# EAGLE design SNIFFR (EAGLE 9.6.0)
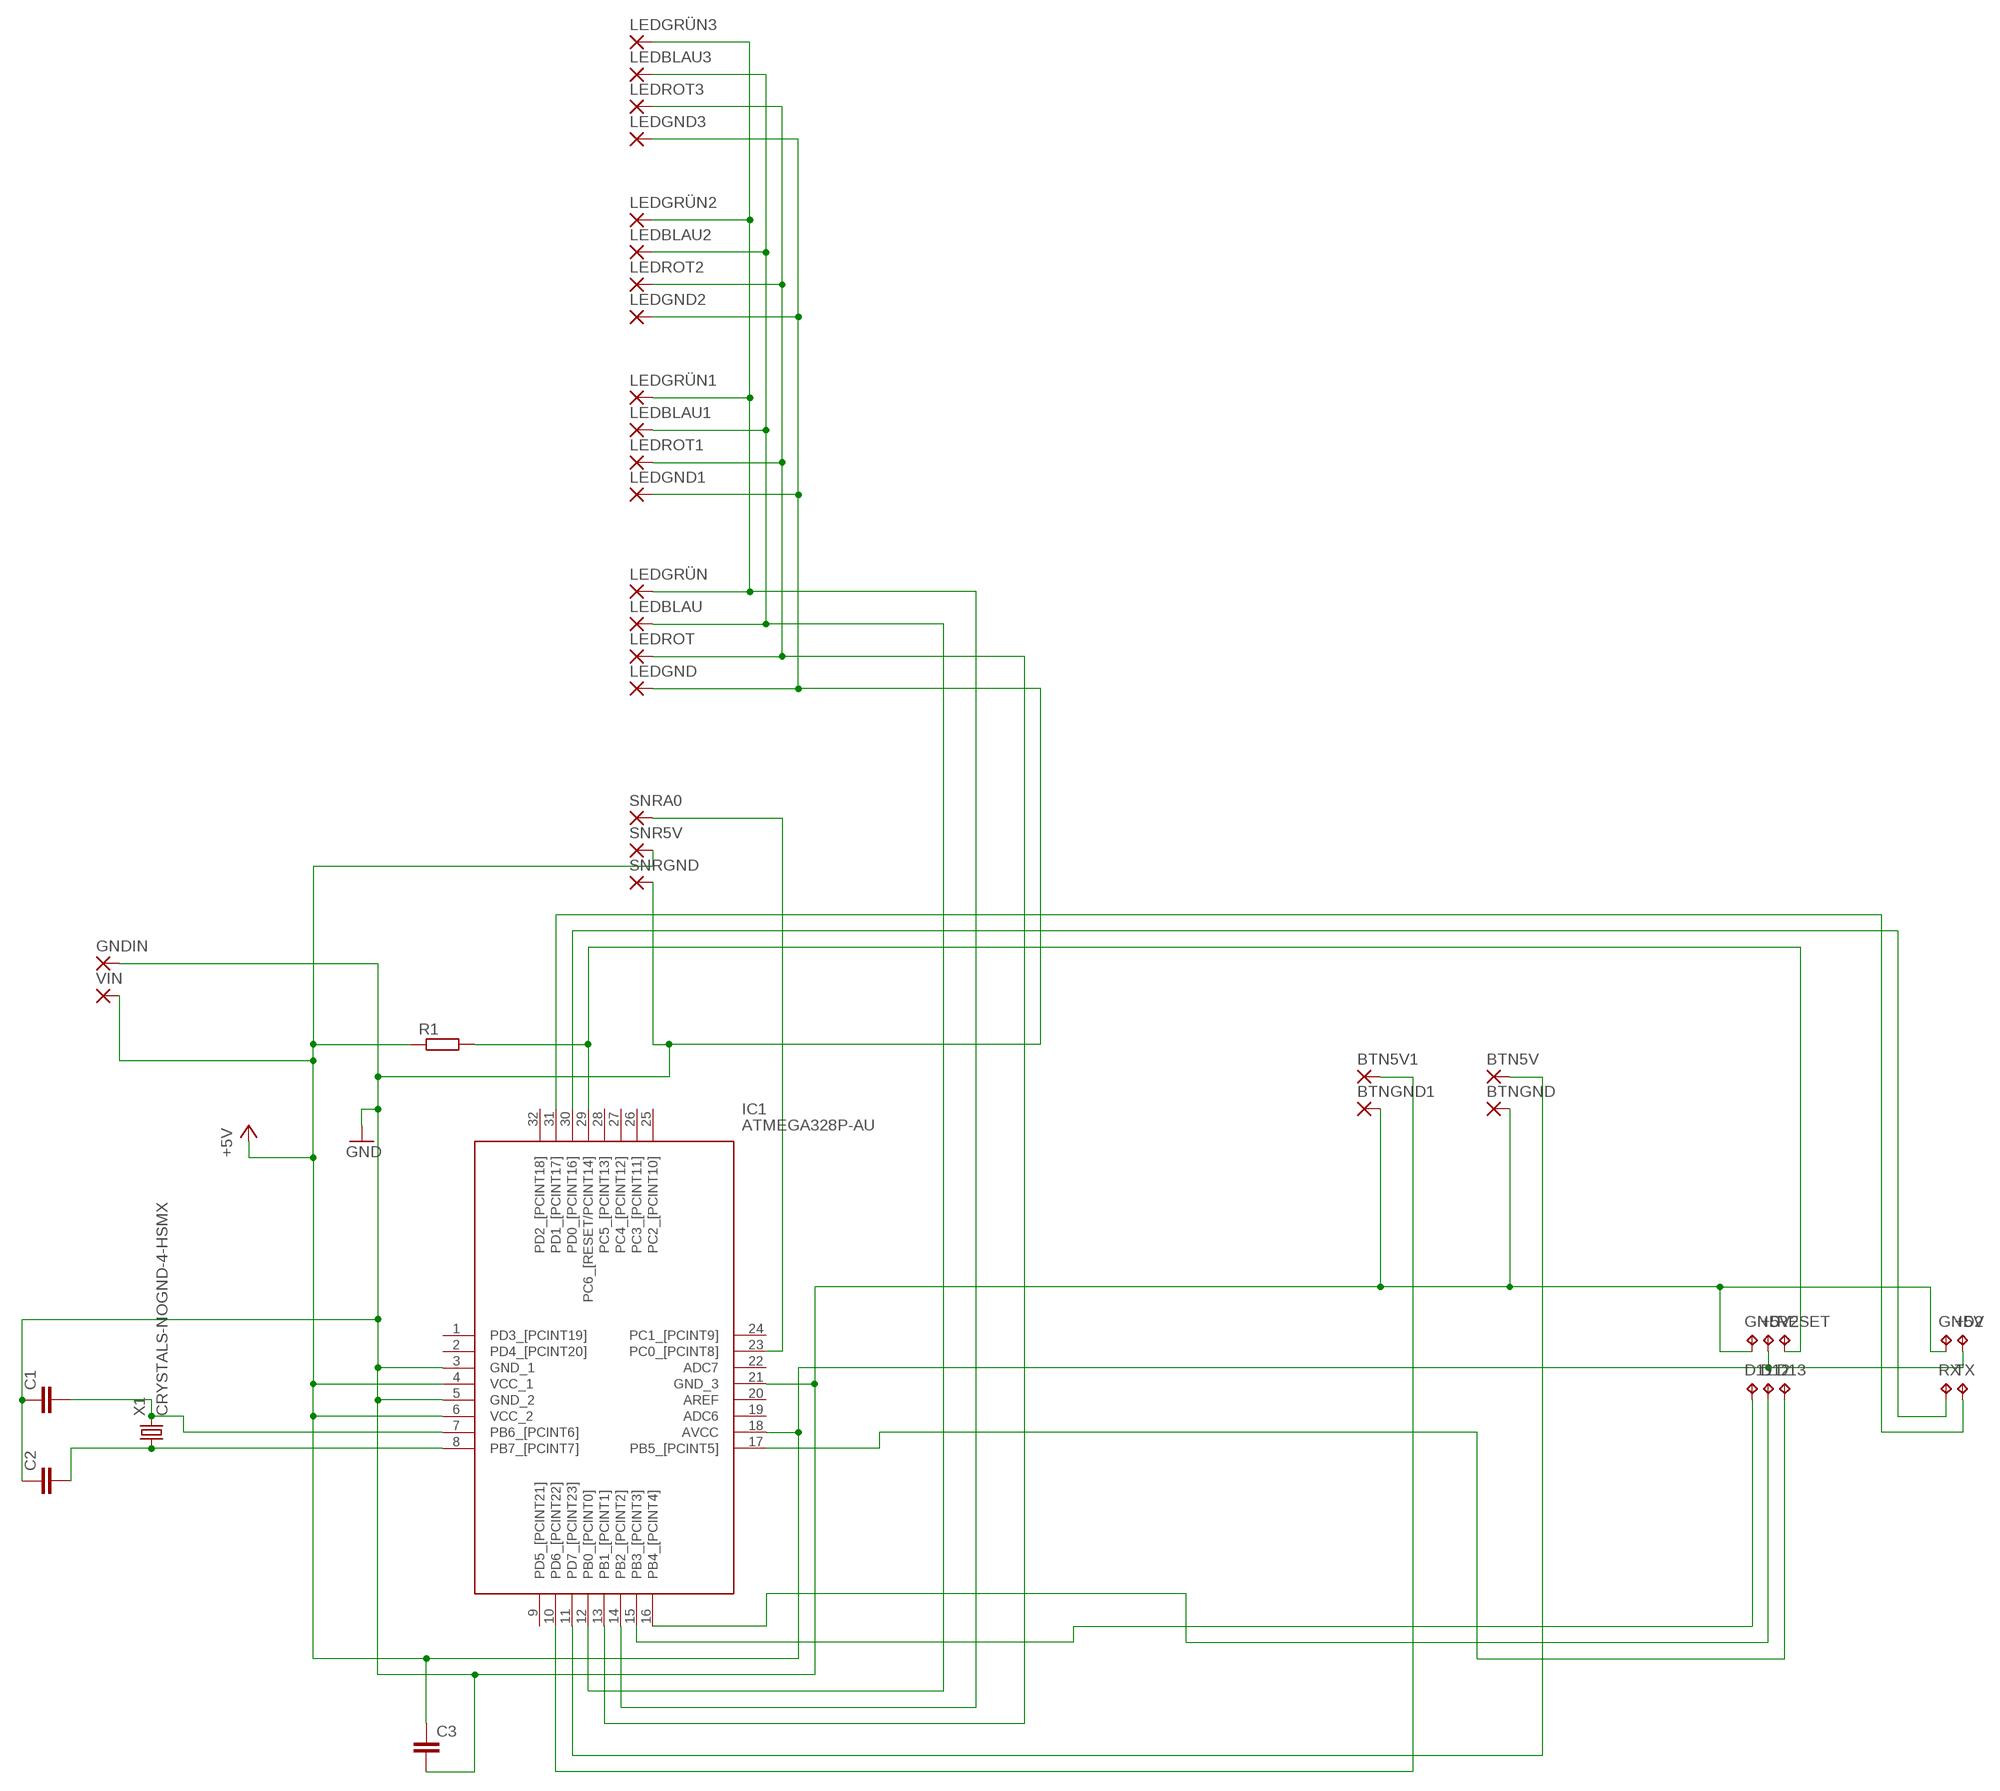
[diagram p0: schematic, sheet 1]

## Parts
+5V  TPTP15SQ  [TP15SQ]
+5V2  TPTP15SQ  [TP15SQ]
BTN5V  2,15/1,0  [2,15/1,0]
BTN5V1  2,15/1,0  [2,15/1,0]
BTNGND  2,15/1,0  [2,15/1,0]
BTNGND1  2,15/1,0  [2,15/1,0]
C1  C-EUC0805  [C0805]
C2  C-EUC0805  [C0805]
C3  C-EUC0805  [C0805]
D11  TPTP15SQ  [TP15SQ]
D12  TPTP15SQ  [TP15SQ]
D13  TPTP15SQ  [TP15SQ]
GND  TPTP15SQ  [TP15SQ]
GND2  TPTP15SQ  [TP15SQ]
GNDIN  2,15/1,0  [2,15/1,0]
IC1  ATMEGA328P-AU  [QFP80P900X900X120-32N]
LEDBLAU  2,15/1,0  [2,15/1,0]
LEDBLAU1  2,15/1,0  [2,15/1,0]
LEDBLAU2  2,15/1,0  [2,15/1,0]
LEDBLAU3  2,15/1,0  [2,15/1,0]
LEDGND  2,15/1,0  [2,15/1,0]
LEDGND1  2,15/1,0  [2,15/1,0]
LEDGND2  2,15/1,0  [2,15/1,0]
LEDGND3  2,15/1,0  [2,15/1,0]
LEDGRÜN  2,15/1,0  [2,15/1,0]
LEDGRÜN1  2,15/1,0  [2,15/1,0]
LEDGRÜN2  2,15/1,0  [2,15/1,0]
LEDGRÜN3  2,15/1,0  [2,15/1,0]
LEDROT  2,15/1,0  [2,15/1,0]
LEDROT1  2,15/1,0  [2,15/1,0]
LEDROT2  2,15/1,0  [2,15/1,0]
LEDROT3  2,15/1,0  [2,15/1,0]
R1  R-EU_R0805  [R0805]
RESET  TPTP15SQ  [TP15SQ]
RX  TPTP15SQ  [TP15SQ]
SNR5V  2,15/1,0  [2,15/1,0]
SNRA0  2,15/1,0  [2,15/1,0]
SNRGND  2,15/1,0  [2,15/1,0]
TX  TPTP15SQ  [TP15SQ]
VIN  2,15/1,0  [2,15/1,0]
X1  CRYSTALS-NOGND-4-HSMX  [HC49-4-HSMX]

## Nets
+5V [POWER]: +5V2.TP +5V.TP C3.1 IC1.4(VCC_1) IC1.6(VCC_2) IC1.18(AVCC) R1.1 SNR5V.1(P) VIN.1(P)
GND [POWER]: BTNGND1.1(P) BTNGND.1(P) C1.1 C2.1 C3.2 GND2.TP GND.TP GNDIN.1(P) IC1.3(GND_1) IC1.5(GND_2) IC1.21(GND_3) LEDGND1.1(P) LEDGND2.1(P) LEDGND3.1(P) LEDGND.1(P) SNRGND.1(P)
N$1: BTN5V1.1(P) IC1.10(PD6_[PCINT22])
N$2 [DATA]: IC1.29(PC6_[RESET/PCINT14]) R1.2 RESET.TP
N$3 [DATA]: C1.2 IC1.7(PB6_[PCINT6]) X1.2
N$4 [DATA]: C2.2 IC1.8(PB7_[PCINT7]) X1.1
N$5: IC1.13(PB1_[PCINT1]) LEDROT1.1(P) LEDROT2.1(P) LEDROT3.1(P) LEDROT.1(P)
N$6: IC1.14(PB2_[PCINT2]) LEDGRÜN1.1(P) LEDGRÜN2.1(P) LEDGRÜN3.1(P) LEDGRÜN.1(P)
N$7: IC1.12(PB0_[PCINT0]) LEDBLAU1.1(P) LEDBLAU2.1(P) LEDBLAU3.1(P) LEDBLAU.1(P)
N$8: IC1.23(PC0_[PCINT8]) SNRA0.1(P)
N$9 [DATA]: D11.TP IC1.15(PB3_[PCINT3])
N$10 [DATA]: D12.TP IC1.16(PB4_[PCINT4])
N$11 [DATA]: D13.TP IC1.17(PB5_[PCINT5])
N$12 [DATA]: IC1.30(PD0_[PCINT16]) RX.TP
N$13 [DATA]: IC1.31(PD1_[PCINT17]) TX.TP
N$15: BTN5V.1(P) IC1.11(PD7_[PCINT23])
Unconnected: IC1.1(PD3_[PCINT19]) IC1.2(PD4_[PCINT20]) IC1.9(PD5_[PCINT21]) IC1.19(ADC6) IC1.20(AREF) IC1.22(ADC7) IC1.24(PC1_[PCINT9]) IC1.25(PC2_[PCINT10]) IC1.26(PC3_[PCINT11]) IC1.27(PC4_[PCINT12]) IC1.28(PC5_[PCINT13]) IC1.32(PD2_[PCINT18])

## Library data of the parts
+5V +5V2 D11-D13 GND GND2 RESET RX TX = testpad:TP: Test pad
BTN5V BTN5V1 BTNGND BTNGND1 GNDIN LEDBLAU LEDBLAU1-LEDBLAU3 LEDGND LEDGND1-LEDGND3 LEDGRÜN LEDGRÜN1-LEDGRÜN3 LEDROT LEDROT1-LEDROT3 SNR5V SNRA0 SNRGND VIN = wirepad:2,15/1,0: THROUGH-HOLE PAD
C1-C3 = rcl:C-EU: CAPACITOR, European symbol; SPICEPREFIX: C
IC1 = ATMEGA328P-AU:ATMEGA328P-AU: MICROCHIP - ATMEGA328P-AU. - MICROCONTROLLER MCU, 8 BIT, ATMEGA, 20MHZ, TQFP-32 Source: Datasheet <https://componentsearchengine.com/Datasheets/2/ATMEGA328P-AU.pdf>; ARROW_PART_NUMBER: ATMEGA328P-AU; ARROW_PRICE-STOCK: https://www.arrow.com/en/products/atmega328p-au/microchip-technology; DESCRIPTION: MICROCHIP - ATMEGA328P-AU. - MICROCONTROLLER MCU, 8 BIT, ATMEGA, 20MHZ, TQFP-32; HEIGHT: 1.2mm; MANUFACTURER_NAME: Microchip; MANUFACTURER_PART_NUMBER: ATMEGA328P-AU; MOUSER_PART_NUMBER: 556-ATMEGA328P-AU; MOUSER_PRICE-STOCK: https://www.mouser.co.uk/ProductDetail/Microchip-Technology-Atmel/ATMEGA328P-AU?qs=K8BHR703ZXiCmmgp6%2FGNmQ%3D%3D
R1 = rcl:R-EU_: RESISTOR, European symbol; SPICEPREFIX: R
X1 = IQD-Frequency-Products:CRYSTALS-NOGND: CRYSTALS CAN NOT GROUNDED

## Net classes
1 POWER: width 0.406 mm
2 DATA: width 0.254 mm

## Board
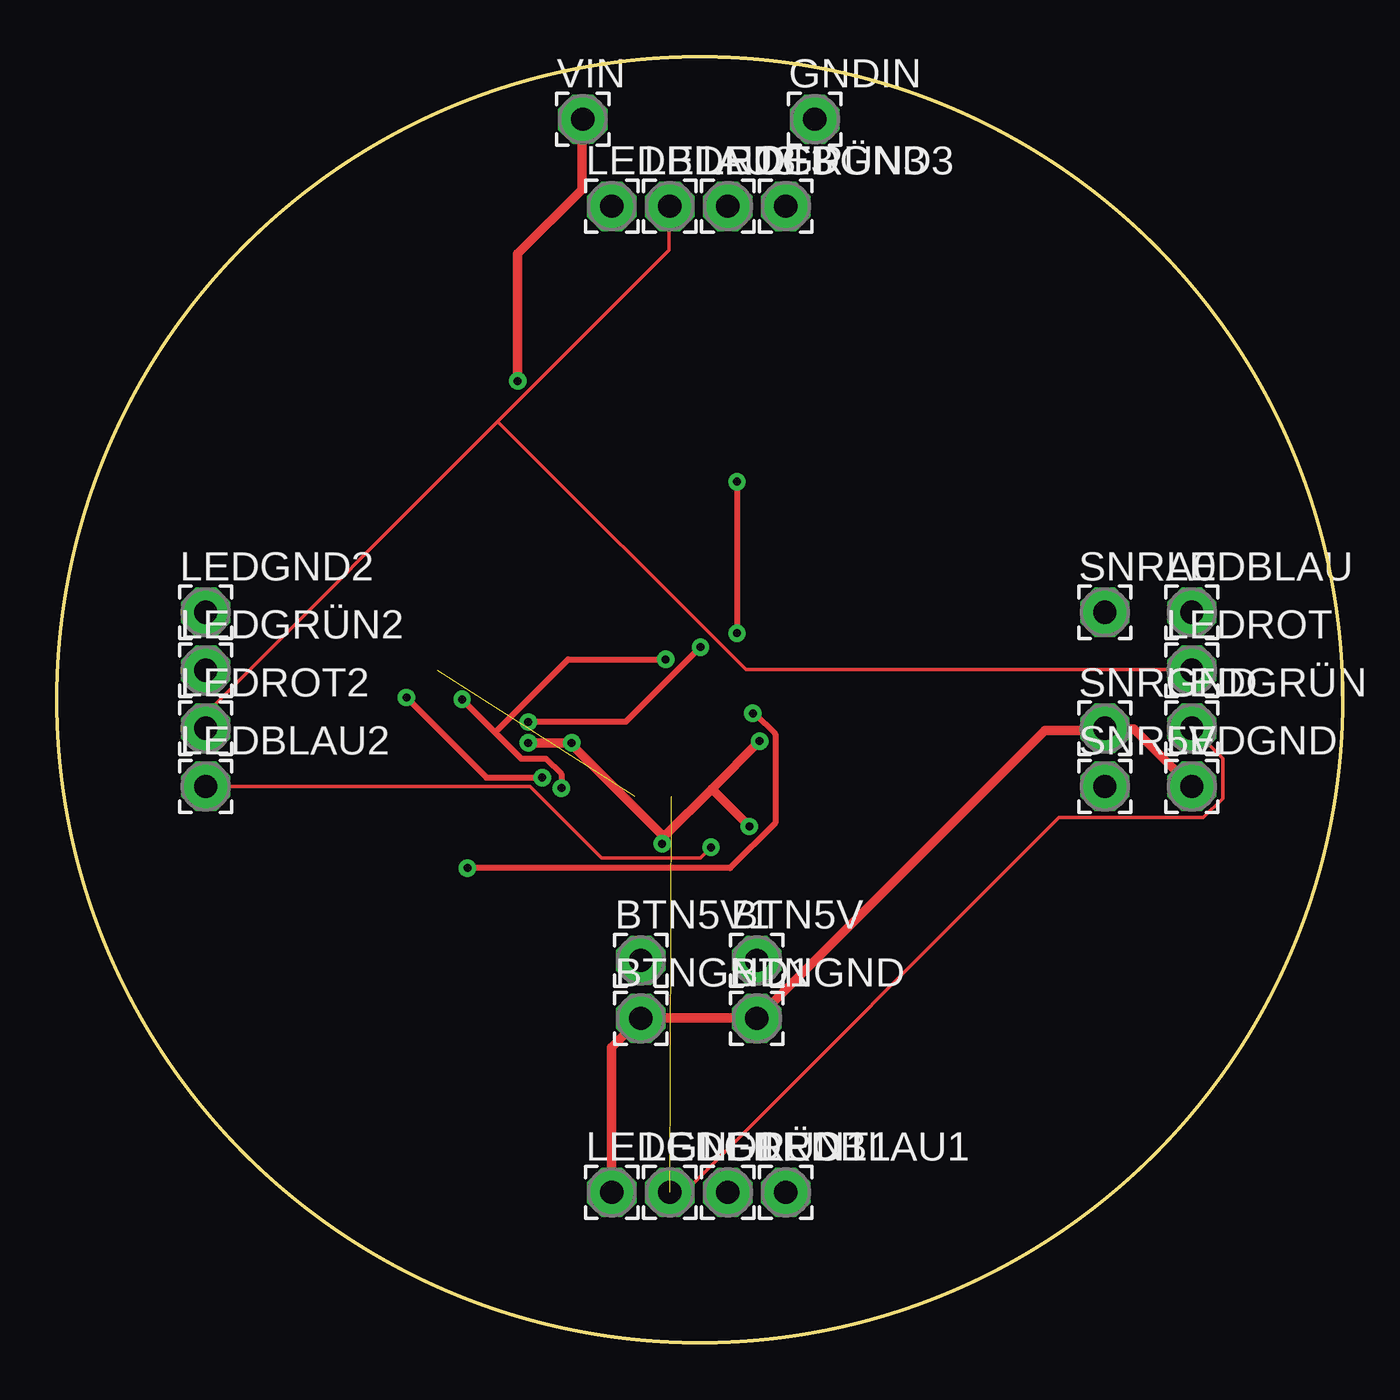
[diagram p1: board, top side]
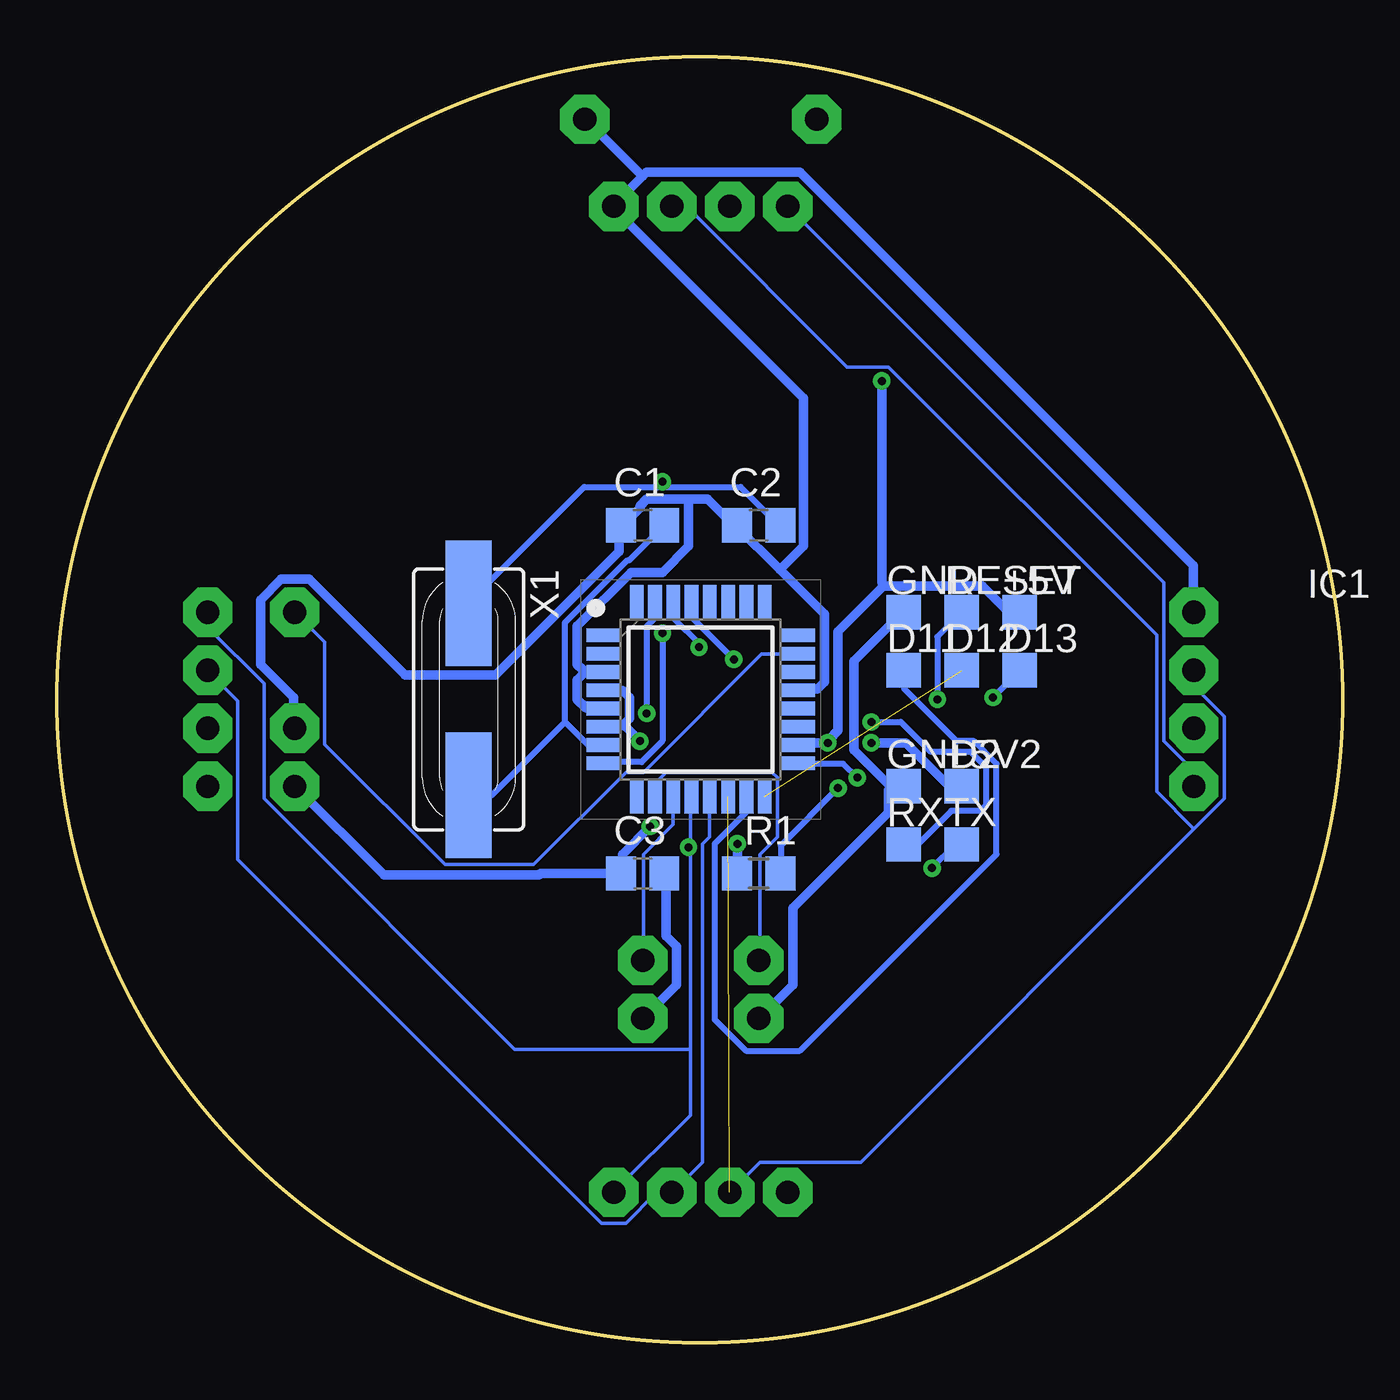
[diagram p2: board, bottom side, seen from below]

Size 56.28 x 56.28 mm. Coordinates in mm from the lower left corner, seen from the top.
Outline: circle at 28.14,28.14 radius 28.14
Copper layers (1*16): Top 0.035mm / dielectric 1.5mm / Bottom 0.035mm
Design rules "default": minimum track width 6mil, minimum drill 0.35mm, track to track 6mil, track to pad 6mil, pad to pad 6mil, via to via 6mil, smd to smd 6mil, copper to edge 40mil, drill to drill 6mil, minimum pad ring 10mil, minimum via ring 8mil, stop-mask expansion 4mil, vias tented up to drill 0mil, thermal gap 10mil

### Footprints (pad centres in the part's own frame; a part is rotated, then mirrored left to right if it is on the bottom)
TP15SQ = smd 1.5 x 1.5: TP 0,0
2,15/1,0 = drill 1.016 pad 2.159 octagon: 1 0,0
C0805 = smd 1.3 x 1.5: 1 -0.95,0; 2 0.95,0
QFP80P900X900X120-32N = smd 1.5 x 0.6: 1 -4.25,2.8; 2 -4.25,2; 3 -4.25,1.2; 4 -4.25,0.4; 5 -4.25,-0.4; 6 -4.25,-1.2; 7 -4.25,-2; 8 -4.25,-2.8; 17 4.25,-2.8; 18 4.25,-2; 19 4.25,-1.2; 20 4.25,-0.4; 21 4.25,0.4; 22 4.25,1.2; 23 4.25,2; 24 4.25,2.8 | smd 0.6 x 1.5: 9 -2.8,-4.25; 10 -2,-4.25; 11 -1.2,-4.25; 12 -0.4,-4.25; 13 0.4,-4.25; 14 1.2,-4.25; 15 2,-4.25; 16 2.8,-4.25; 25 2.8,4.25; 26 2,4.25; 27 1.2,4.25; 28 0.4,4.25; 29 -0.4,4.25; 30 -1.2,4.25; 31 -2,4.25; 32 -2.8,4.25
R0805 = smd 1.3 x 1.5: 1 -0.95,0; 2 0.95,0
HC49-4-HSMX = smd 5.5 x 2: 1 -4.2,0; 2 4.2,0

### Placement (x,y rotation side)
+5V  14.13,31.97 0 bottom
+5V2  16.67,24.35 0 bottom
BTN5V  30.64,16.73 0 top
BTN5V1  25.56,16.73 0 top
BTNGND  30.64,14.19 0 top
BTNGND1  25.56,14.19 0 top
C1  30.64,35.78 0 bottom
C2  25.56,35.78 0 bottom
C3  30.64,20.54 0 bottom
D11  19.21,29.43 0 bottom
D12  16.67,29.43 0 bottom
D13  14.13,29.43 0 bottom
GND  19.21,31.97 0 bottom
GND2  19.21,24.35 0 bottom
GNDIN  33.18,53.56 0 top
IC1  28.1,28.16 0 bottom
LEDBLAU  49.69,31.97 0 top
LEDBLAU1  31.91,6.57 0 top
LEDBLAU2  6.51,24.35 0 top
LEDBLAU3  24.29,49.75 0 top
LEDGND  49.69,24.35 0 top
LEDGND1  24.29,6.57 0 top
LEDGND2  6.51,31.97 0 top
LEDGND3  31.91,49.75 0 top
LEDGRÜN  49.69,26.89 0 top
LEDGRÜN1  26.83,6.57 0 top
LEDGRÜN2  6.51,29.43 0 top
LEDGRÜN3  29.37,49.75 0 top
LEDROT  49.69,29.43 0 top
LEDROT1  29.37,6.57 0 top
LEDROT2  6.51,26.89 0 top
LEDROT3  26.83,49.75 0 top
R1  25.56,20.54 0 bottom
RESET  16.67,31.97 0 bottom
RX  19.21,21.81 0 bottom
SNR5V  45.88,24.35 0 top
SNRA0  45.88,31.97 0 top
SNRGND  45.88,26.89 0 top
TX  16.67,21.81 0 bottom
VIN  23.02,53.56 0 top
X1  38.26,28.16 270 bottom

### Tracks (layer width: path | path; a pad name or v marks a point on that pad's centre or on a via)
+5V  (via drill 0.35)
  Top 0.406: v20.63,26.25 v22.54,26.25 22.61,26.1 26.5,22.21 | 26.5,22.21 v26.5,21.83 | 28.67,24.23 26.65,22.21 26.5,22.21 | 28.67,24.23 v30.77,26.33 | v20.17,42.1 20.17,47.67 22.99,50.49 22.99,53.53 VIN.1 | 28.67,24.23 v30.31,22.6
  Bottom 0.406: SNR5V.1 45.85,24.35 41.97,20.46 35.19,20.46 35.11,20.54 C3.1 31.53,20.69 31.53,21.38 v30.31,22.6 | 31.53,27.02 32.29,27.02 IC1.6 | 31.53,27.02 31.22,27.32 31.22,28.23 31.53,28.54 32.29,28.54 IC1.4 | +5V2.TP 17.2,24.35 19.11,26.25 v20.63,26.25 | IC1.18 23.83,26.18 23.76,26.25 v22.54,26.25 22.46,26.41 22.08,26.79 22.08,31.13 20.1,33.11 | +5V.TP 14.61,31.97 15.75,33.11 20.1,33.11 | v26.5,21.83 R1.1 | v30.77,26.33 31.38,26.94 31.53,27.02 | v20.17,42.1 20.17,33.26 20.1,33.11
GND
  Top 0.406: LEDGND.1 49.66,24.35 47.15,26.86 45.93,26.86 SNRGND.1 45.7,26.79 43.26,26.79 30.77,14.29 BTNGND.1 30.61,14.21 25.74,14.21 BTNGND1.1 24.29,12.92 LEDGND1.1
  Bottom 0.406: 33.2,29.3 33.51,29 33.51,28.16 33.13,27.78 32.37,27.78 IC1.5 | 33.2,29.3 32.37,29.3 IC1.3 | 24.63,33.84 26.57,35.78 C2.1 26.73,35.85 27.79,36.92 28.63,36.92 | 24.63,33.84 22.69,31.89 22.69,28.92 22.99,28.62 23.83,28.62 IC1.21 | 28.63,36.92 30.46,36.92 30.77,36.62 30.77,36.54 31.53,35.78 C1.1 31.68,35.63 31.68,34.64 37.09,29.23 41.05,29.23 45.24,33.42 46.46,33.42 47.38,32.5 47.38,29.68 45.93,28.23 45.93,26.94 SNRGND.1 | 28.63,36.92 28.63,34.86 29.77,33.72 31.15,33.72 33.51,31.36 33.51,29.68 33.28,29.45 33.2,29.3 | 30.65,51.06 31.91,49.8 LEDGND3.1 31.83,49.57 23.6,41.34 23.6,34.86 24.63,33.84 | 30.65,51.06 30.46,51.25 23.76,51.25 6.53,34.03 6.53,31.97 LEDGND2.1 | 30.65,51.06 33.13,53.53 GNDIN.1 | BTNGND.1 29.17,15.66 29.17,17.34 29.62,17.8 29.62,20.54 C3.2 | GND.TP 19.26,31.97 21.39,29.83 21.39,25.95 19.79,24.35 GND2.TP 19.87,24.2 19.87,23.21 24.06,19.01 24.06,15.66 25.51,14.21 BTNGND1.1
N$1
  Bottom 0.152: IC1.10 30.08,23.97 30.08,24.5 29.62,24.96 24.97,24.96 24.75,24.73 24.75,22.14 25.51,21.38 25.51,16.73 BTN5V1.1
N$2  (via drill 0.35)
  Top 0.254: v22.08,24.27 22.08,24.88 21.39,25.57 20.33,25.57 19.18,26.71 | v17.74,28.16 19.18,26.71 | v26.65,29.91 22.38,29.91 19.18,26.71
  Bottom 0.254: v22.08,24.27 24.59,21.76 24.59,20.54 R1.2 | v17.74,28.16 17.74,30.9 RESET.TP | v26.65,29.91 28.48,31.74 28.48,32.35 IC1.29
N$3
  Bottom 0.254: 34.04,27.17 34.04,31.51 31.3,34.25 31.22,34.25 C1.2 | 34.04,27.17 33.05,26.18 32.37,26.18 IC1.7 | 34.04,27.17 37.24,23.97 38.23,23.97 X1.2
N$4  (via drill 0.35)
  Top 0.254: v29.77,37.68 v29.77,31.05
  Bottom 0.254: 29.77,37.45 33.2,37.45 38.23,32.43 X1.1 | 29.77,37.45 26.35,37.45 24.67,35.78 C2.2 | v29.77,31.05 29.77,26.33 30.69,25.42 32.29,25.42 IC1.8 | 29.77,37.45 v29.77,37.68
N$5
  Top 0.152: 19.3,40.31 26.8,47.82 26.8,49.72 LEDROT3.1 | 19.3,40.31 6.53,27.55 6.53,26.94 LEDROT2.1 | 19.3,40.31 30.16,29.45 49.66,29.45 LEDROT.1
  Bottom 0.152: IC1.13 27.72,23.89 27.72,22.14 28.02,21.83 28.02,7.89 29.32,6.59 LEDROT1.1 29.39,6.52 30.08,6.52 31.38,5.22 32.44,5.22 48.37,21.15 48.37,28.08 49.66,29.38 LEDROT.1
N$6  (1 unrouted)
  Top 0.152: LEDGRÜN1.1 26.88,6.59 27.49,6.59 43.87,22.98 50.2,22.98 51.03,23.82 51.03,25.57 49.74,26.86 LEDGRÜN.1
  Bottom 0.152: 6.5,22.48 21.09,7.89 25.51,7.89 LEDGRÜN1.1 | 6.5,22.48 5.16,23.82 5.16,27.4 6.46,28.69 6.46,29.38 LEDGRÜN2.1 | 6.5,22.48 8.13,24.12 8.13,30.98 19.87,42.71 21.7,42.71 28.71,49.72 29.32,49.72 LEDGRÜN3.1
N$7  (via drill 0.35)
  Top 0.152: LEDBLAU2.1 20.71,24.35 23.83,21.22 28.17,21.22 v28.63,21.68
  Bottom 0.152: LEDBLAU2.1 6.53,24.35 6.53,25.03 7.83,26.33 7.83,33.26 24.29,49.72 LEDBLAU3.1 | 28.56,12.84 28.56,9.95 31.91,6.59 LEDBLAU1.1 | 28.56,12.84 28.56,21.68 | 28.56,21.68 28.56,23.89 IC1.12 | 28.56,12.84 36.25,12.84 47.22,23.82 47.22,28.84 49.66,31.28 49.66,31.97 LEDBLAU.1 | 28.56,21.68 v28.63,21.68
N$8
  Bottom 0.152: IC1.23 23.91,30.14 25.43,30.14 30.61,24.96 31.38,24.96 35.41,20.92 39.3,20.92 44.56,26.18 44.56,30.67 45.85,31.97 SNRA0.1
N$9
  Bottom 0.254: D11.TP 19.18,29.38 19.18,28.62 16.9,26.33 16.14,26.33 15.14,25.34 15.14,21.38 23.76,12.77 26.12,12.77 27.49,14.14 27.49,21.83 26.12,23.21 26.12,23.89 IC1.15
N$10  (1 unrouted)
N$11  (via drill 0.35)
  Top 0.254: v21.24,24.73 18.8,24.73 v15.3,28.23
  Bottom 0.254: v21.24,24.73 21.85,25.34 23.83,25.34 IC1.17 | v15.3,28.23 14.15,29.38 D13.TP
N$12  (via drill 0.35)
  Top 0.254: v20.63,27.17 24.9,27.17 v28.17,30.44
  Bottom 0.254: v20.63,27.17 19.34,27.17 18.04,25.87 16.29,25.87 15.6,25.19 15.6,23.51 15.83,23.28 17.13,23.28 18.57,21.83 19.18,21.83 RX.TP | v28.17,30.44 28.17,30.6 29.24,31.66 29.24,32.35 IC1.30
N$13  (via drill 0.35)
  Top 0.254: v17.96,20.77 29.47,20.77 31.45,22.75 31.45,26.63 30.54,27.55 v30.46,27.55
  Bottom 0.254: v17.96,20.77 16.97,21.76 16.67,21.76 TX.TP | v30.46,27.55 30.46,31.36 30.16,31.66 30.16,32.35 IC1.31
N$15
  Bottom 0.152: IC1.11 29.32,23.89 29.32,22.67 30.61,21.38 30.61,16.73 BTN5V.1

### Text on the board
200bmp: /Users/vincent/Desktop/SNIFFR® by Studio IKGK-3.bmp